# Altium project tiny-plane.PrjPcb
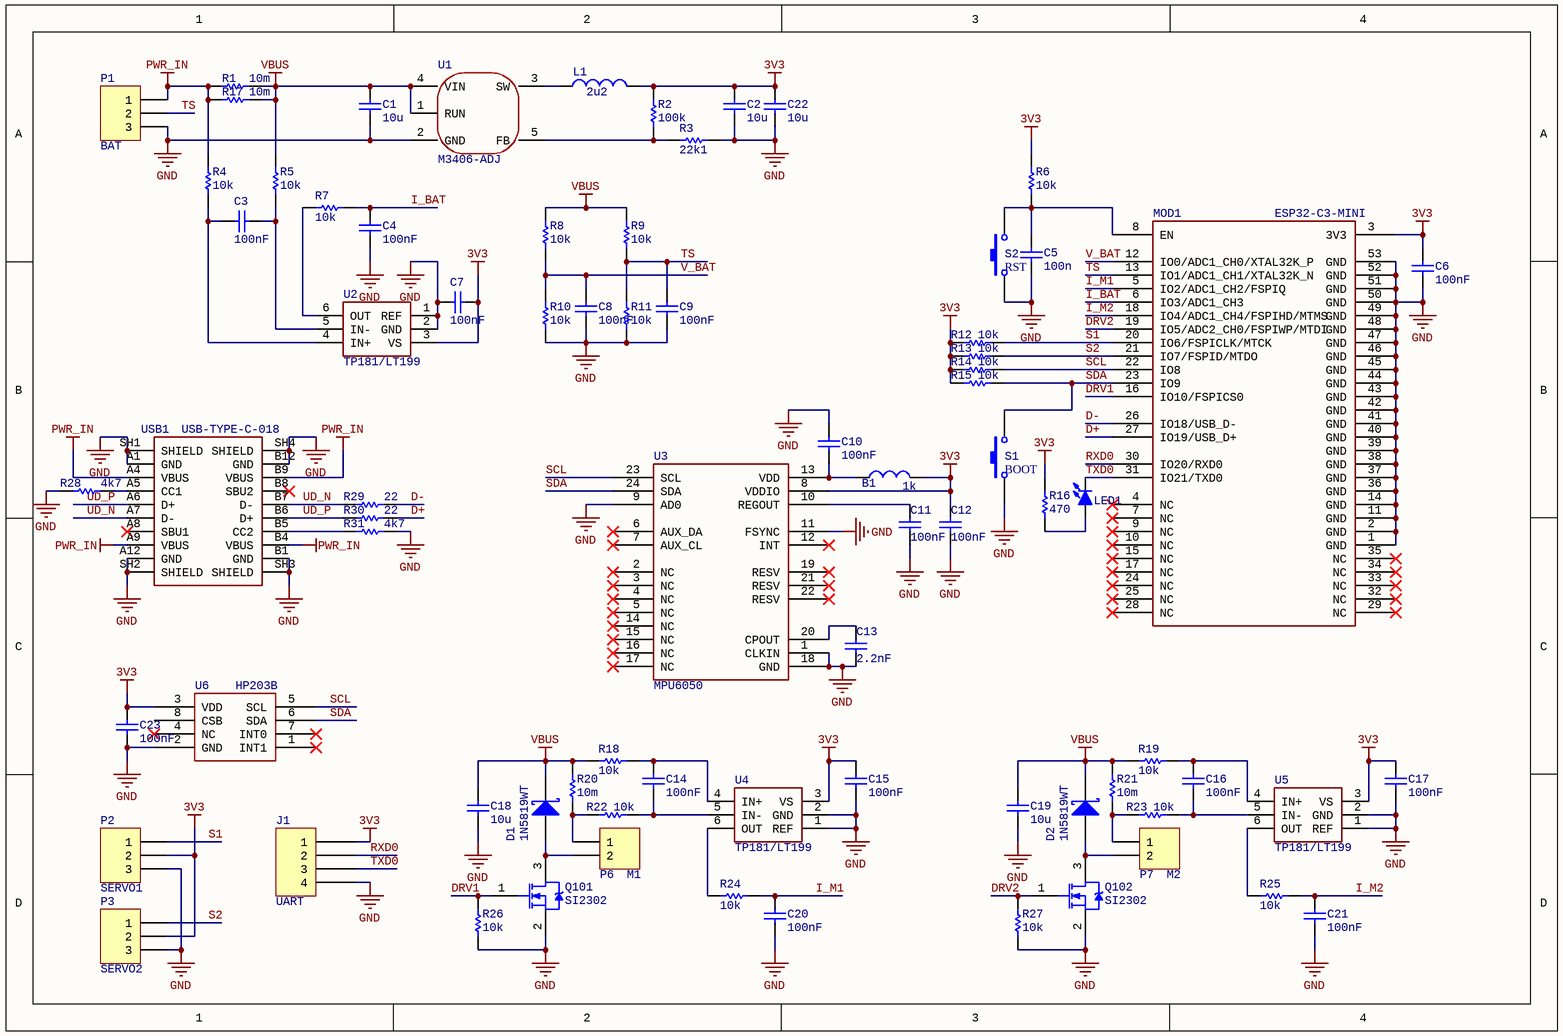
[diagram p0: esp-plane-u.SchDoc]
1 sheet, 77 parts. Net scope: global (net labels, ports and power ports of the same name join across sheets).
Board file: esp-plane.PcbDoc

## Sheet esp-plane-u.SchDoc
size A4; SheetNumber: 1; SheetTotal: 1; SPICEModelCacheZWEIZCEH: <root> / <DocumentId>ZWEIZCEH</DocumentId> / <CacheFrame Number="0"> / <Model Name="skydiode" Kind="MDL"> / <Text>*Default Schottky Diode / *Schottky Diode Pinout: A,K / .MODEL SKYDIODE D(EG=0.69 XTI=2)</Text> / </Model> / </CacheFrame> / </root>

### Parts
B1  value 1k  [RESC100X50X35L25N]  (hidden comment: BEAD-470-100MHZ-1A-0603-BLM18PG471SN1)
C1  10u  [CAPC160X80X90L30N]
C2  10u  [CAPC160X80X90L30N]
C3  100nF  [CAPC100X50X55L25N]
C4  100nF  [CAPC100X50X55L25N]
C5  100n  [CAPC100X50X55L25N]
C6  100nF  [CAPC100X50X55L25N]
C7  100nF  [CAPC100X50X55L25N]
C8  100nF  [CAPC100X50X55L25N]
C9  100nF  [CAPC100X50X55L25N]
C10  100nF  [CAPC100X50X55L25N]
C11  100nF  [CAPC100X50X55L25N]
C12  100nF  [CAPC100X50X55L25N]
C13  2.2nF  [CAPC100X50X55L25N]
C14  100nF  [CAPC100X50X55L25N]
C15  100nF  [CAPC100X50X55L25N]
C16  100nF  [CAPC100X50X55L25N]
C17  100nF  [CAPC100X50X55L25N]
C18  10u  [CAPC160X80X90L30N]
C19  10u  [CAPC160X80X90L30N]
C20  100nF  [CAPC100X50X55L25N]
C21  100nF  [CAPC100X50X55L25N]
C22  10u  [CAPC160X80X90L30N]
C23  100nF  [CAPC100X50X55L25N]
D1  1N5819WT  [SOD-523]
D2  1N5819WT  [SOD-523]
J1  UART  [FPC-SMD_4P-P1.25_DEALON_1.25-4PS]
L1  value 2u2  [INDC200X160X105L60N]  (hidden comment: Inductor)
LED1  蓝灯 正贴  [LEDC100X50X45L25N]  (value not drawn)
MOD1  ESP32-C3-MINI  [ESP32-C3-MINI-1U]
P1  BAT  [BC-1-319]
P2  SERVO1  [FPC-SMD_3P-P1.25_DEALON_1.25-3PS-1]
P3  SERVO2  [FPC-SMD_3P-P1.25_DEALON_1.25-3PS-1]
P6  M1  [CONN-SMD_2P-P1.25_DEALON_1.25-2PS]
P7  M2  [CONN-SMD_2P-P1.25_DEALON_1.25-2PS]
Q101  SI2302  [SOT23-3P95_237X111L52X43N]
Q102  SI2302  [SOT23-3P95_237X111L52X43N]
R1  10m  [RES 0603/1608]
R2  100k  [RESC100X50X35L25N]
R3  22k1  [RESC100X50X35L25N]
R4  10k  [RESC100X50X35L25N]
R5  10k  [RESC100X50X35L25N]
R6  10k  [RESC100X50X35L25N]
R7  10k  [RESC100X50X35L25N]
R8  10k  [RESC100X50X35L25N]
R9  10k  [RESC100X50X35L25N]
R10  10k  [RESC100X50X35L25N]
R11  10k  [RESC100X50X35L25N]
R12  10k  [RESC100X50X35L25N]
R13  10k  [RESC100X50X35L25N]
R14  10k  [RESC100X50X35L25N]
R15  10k  [RESC100X50X35L25N]
R16  470  [RESC100X50X35L25N]
R17  10m  [RES 0603/1608]
R18  10k  [RESC100X50X35L25N]
R19  10k  [RESC100X50X35L25N]
R20  10m  [RES 0603/1608]
R21  10m  [RES 0603/1608]
R22  10k  [RESC100X50X35L25N]
R23  10k  [RESC100X50X35L25N]
R24  10k  [RESC100X50X35L25N]
R25  10k  [RESC100X50X35L25N]
R26  10k  [RESC100X50X35L25N]
R27  10k  [RESC100X50X35L25N]
R28  4k7  [RESC100X50X35L25N]
R29  22  [RESC100X50X35L25N]
R30  22  [RESC100X50X35L25N]
R31  4k7  [RESC100X50X35L25N]
S1  BOOT  [KEY-3*4]
S2  RST  [KEY-3*4]
U1  M3406-ADJ  [SOT23-5P95_280X110L37X40N]
U2  TP181/LT199  [SC-70-6_L2.0-W1.3-P0.65-LS2.2-BL]
U3  MPU6050  [IMU-3000]
U4  TP181/LT199  [SC-70-6_L2.0-W1.3-P0.65-LS2.2-BL]
U5  TP181/LT199  [SC-70-6_L2.0-W1.3-P0.65-LS2.2-BL]
U6  HP203B  [HP203B]
USB1  USB-TYPE-C-018  [USB-TYPE-C-018]

### Nets
3V3: B1.2 C2.2 C6.2 C7.1 C12.1 C15.2 C17.2 C22.2 C23.1 J1.1 L1.2 MOD1.3(3V3) P2.2 P3.2 R2.2 R6.2 R12.1 R13.1 R14.1 R15.1 R16.2 U2.3(VS) U3.8(VDDIO) U4.3(VS) U5.3(VS) U6.3(VDD)
GND: C1.1 C2.1 C4.1 C5.1 C6.1 C7.2 C8.2 C9.2 C10.1 C11.1 C12.2 C13.1 C15.1 C17.1 C18.1 C19.1 C20.1 C21.1 C22.1 C23.2 J1.4 MOD1.1(GND) MOD1.2(GND) MOD1.11(GND) MOD1.14(GND) MOD1.36(GND) MOD1.37(GND) MOD1.38(GND) MOD1.39(GND) MOD1.40(GND) MOD1.41(GND) MOD1.42(GND) MOD1.43(GND) MOD1.44(GND) MOD1.45(GND) MOD1.46(GND) MOD1.47(GND) MOD1.48(GND) MOD1.49(GND) MOD1.50(GND) MOD1.51(GND) MOD1.52(GND) MOD1.53(GND) P1.3 P2.3 P3.3 Q101.2(S) Q102.2(S) R3.1 R10.1 R11.1 R26.1 R27.1 R28.2 R31.1 S1.2 S2.2 U1.2(GND) U2.1(REF) U2.2(GND) U3.1(CLKIN) U3.9(AD0) U3.11(FSYNC) U3.18(GND) U4.1(REF) U4.2(GND) U5.1(REF) U5.2(GND) U6.2(GND) USB1.A1(GND) USB1.A12(GND) USB1.B1(GND) USB1.B12(GND) USB1.SH1(SHIELD) USB1.SH2(SHIELD) USB1.SH3(SHIELD) USB1.SH4(SHIELD)
PWR_IN: P1.1 R1.2 R4.1 R17.2 USB1.A4(VBUS) USB1.A9(VBUS) USB1.B4(VBUS) USB1.B9(VBUS)
VBUS: C1.2 C18.2 C19.2 D1.2(K) D2.2(K) R1.1 R5.1 R8.2 R9.2 R17.1 R18.1 R19.1 R20.2 R21.2 U1.1(RUN) U1.4(VIN)
D+: MOD1.27(IO19/USB_D+) R30.1
D-: MOD1.26(IO18/USB_D-) R29.1
DRV1: MOD1.16(IO10/FSPICS0) Q101.1(G) R26.2
DRV2: MOD1.19(IO5/ADC2_CH0/FSPIWP/MTDI) Q102.1(G) R27.2
I_BAT: C4.2 MOD1.6(IO3/ADC1_CH3) R7.2
I_M1: C20.2 MOD1.5(IO2/ADC1_CH2/FSPIQ) R24.2
I_M2: C21.2 MOD1.18(IO4/ADC1_CH4/FSPIHD/MTMS) R25.2
RXD0: J1.2 MOD1.30(IO20/RXD0)
S1: MOD1.20(IO6/FSPICLK/MTCK) P2.1 R12.2
S2: MOD1.21(IO7/FSPID/MTDO) P3.1 R13.2
SCL: MOD1.22(IO8) R14.2 U3.23(SCL) U6.5(SCL)
SDA: MOD1.23(IO9) R15.2 S1.1 U3.24(SDA) U6.6(SDA)
TS: C9.1 MOD1.13(IO1/ADC1_CH1/XTAL32K_N) P1.2 R9.1 R11.2
TXD0: J1.3 LED1.C(K) MOD1.31(IO21/TXD0)
UD_N: R29.2 USB1.A7(D-) USB1.B7(D-)
UD_P: R30.2 USB1.A6(D+) USB1.B6(D+)
V_BAT: C8.1 MOD1.12(IO0/ADC1_CH0/XTAL32K_P) R8.1 R10.2
NetB1_1: B1.1 C10.2 U3.13(VDD)
NetC3_1: C3.1 R4.2 U2.4(IN+)
NetC3_2: C3.2 R5.2 U2.5(IN-)
NetC5_2: C5.2 MOD1.8(EN) R6.1 S2.1
NetC11_2: C11.2 U3.10(REGOUT)
NetC13_2: C13.2 U3.20(CPOUT)
NetC14_1: C14.1 R22.2 U4.5(IN-)
NetC14_2: C14.2 R18.2 U4.4(IN+)
NetC16_1: C16.1 R23.2 U5.5(IN-)
NetC16_2: C16.2 R19.2 U5.4(IN+)
NetD1_1: D1.1(A) P6.2 Q101.3(D)
NetD2_1: D2.1(A) P7.2 Q102.3(D)
NetL1_1: L1.1 U1.3(SW)
NetLED1_A: LED1.A R16.1
NetP6_1: P6.1 R20.1 R22.1
NetP7_1: P7.1 R21.1 R23.1
NetR2_1: R2.1 R3.2 U1.5(FB)
NetR7_1: R7.1 U2.6(OUT)
NetR24_1: R24.1 U4.6(OUT)
NetR25_1: R25.1 U5.6(OUT)
NetR28_1: R28.1 USB1.A5(CC1)
NetR31_2: R31.2 USB1.B5(CC2)

Not connected (* = marked no-connect by the designer): MOD1 4(NC)* 7(NC)* 9(NC)* 10(NC)* 15(NC)* 17(NC)* 24(NC)* 25(NC)* 28(NC)* 29(NC)* 32(NC)* 33(NC)* 34(NC)* 35(NC)*; U3 2(NC)* 3(NC)* 4(NC)* 5(NC)* 6(AUX_DA)* 7(AUX_CL)* 12(INT)* 14(NC)* 15(NC)* 16(NC)* 17(NC)* 19(RESV)* 21(RESV)* 22(RESV)*; U6 1(INT1)* 4(NC)* 7(INT0)* 8(CSB); USB1 A8(SBU1)* B8(SBU2)*

### Library data of the parts
B1 = BEAD-470-100MHZ-1A-0603-BLM18PG471SN1: DCR 0.03,2A  0603; MPN: GZ1005D102CTF; 制造商: Murata; 物料描述: 贴片磁珠 470ohm@100M,1000mA, 0.2ohm, 0603; 编号: C96679; 规格型号: BLM18PG471SN1
C1 C2 C22 = GRM188R61E106KA73D: MPN: TCC0603X5R106K100CT; 编号: C380314; Value: 10u
C3 C4 C6-C9 C14-C17 C20 C21 = Cap: Capacitor; 编号: C359190; Value: 100nF
C5 = GRM188R61E106KA73D: MPN: TCC0603X5R106K100CT; 编号: C359190; value: 100n
C10-C12 C23 = Cap Semi: Capacitor (Semiconductor SIM Model); 编号: C359190; Value: 100nF
C13 = Cap Semi: Capacitor (Semiconductor SIM Model); 编号: C1531; Value: 2.2nF
C18 C19 = Cap: Capacitor; 编号: C380314; Value: 10u
D1 D2 = D Schottky: Schottky Diode; 编号: C5451630
J1 = 4 Pin: 编号: C2904991
L1 = WPN201610U2R2MTY01: MPN: SFE201610-2R2M; 编号: C5159659
LED1 = LED-SMD: 贴片LED; 编号: C965795
MOD1 = ESP32-C3-MINI: 编号: C2911374
P1 = Header 3: Header, 3-Pin
P2 P3 = Header 3: Header, 3-Pin; 编号: C2904990
P6 P7 = Header 2: Header, 2-Pin; 编号: C2904989
Q101 Q102 = NMOS-2: N-Channel Power MOSFET; 编号: C2834503
R1 R17 R20 R21 = Res1: Resistor; 编号: C2912774; Value: 10m
R2 = RC0402FR-07100KL: MPN: RTT021003FTH; 编号: C102750; Value: 100k
R3 = RC0402FR-0722K1L: MPN: RTT022212FTH; 编号: C43473; Value: 22k1
R4 R5 R7-R11 R18 R19 R22-R27 = Res1: Resistor; 编号: C25744; Value: 10k
R6 = RC0402FR-0722K1L: MPN: RTT022212FTH; 编号: C25744; value: 10k
R12-R15 = RC0402FR-07100KL: MPN: RTT02471JTH; 编号: C25744; value: 10k
R16 = RC0402FR-07100KL: MPN: RTT02471JTH; 编号: C103058; value: 470
R28 R31 = RC0402FR-07100KL: MPN: RTT02472JTH; 编号: C103059; value: 4k7
R29 R30 = RC0402FR-07100KL: MPN: RTT02472JTH; 编号: C25092; value: 22
S1 S2 = SW-PB: Switch; 编号: C5373431; Revision: July-2002: Re-released for DXP Platform.
U1 = M3406-ADJ: Vin=2V~6V,800mA,DCDC; 编号: C83224; MPN: M3406-ADJ
U2 U4 U5 = LT199_SC70-6L: 编号: C2902349
U3 = MPU6050: 编号: C24112
U6 = HP203B: 编号: C138665
USB1 = USB-TYPE-C-018: 编号: C2927038